# Altium schematic sheet Motor Phase.SchDoc
size A; SheetNumber: 4; SheetTotal: 4
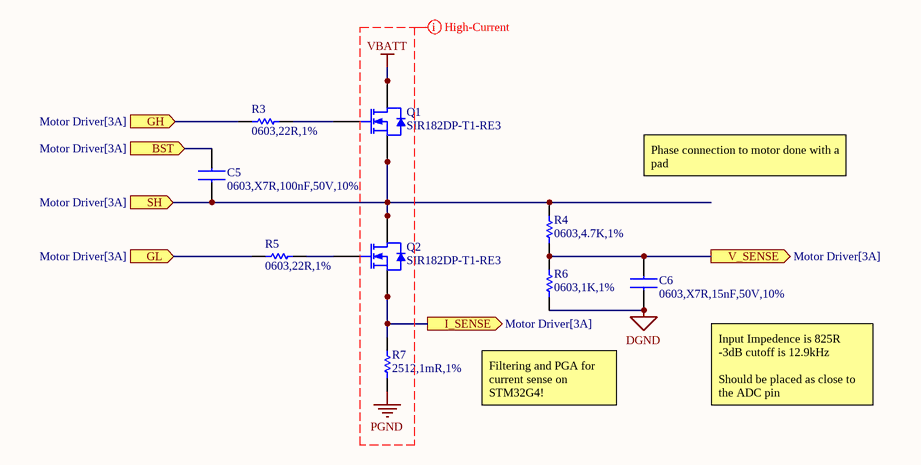
[diagram p0: Motor Phase.SchDoc]

## Parts
C5  0603,X7R,100nF,50V,10%  [CAPC1608X90N]
C6  0603,X7R,15nF,50V,10%  [CAPC1608X90N]
Q1  SIR182DP-T1-RE3  [POWERPAK-SO-8_L5.9-W4.9-P1.27-LS6.2-BL]
Q2  SIR182DP-T1-RE3  [POWERPAK-SO-8_L5.9-W4.9-P1.27-LS6.2-BL]
R3  0603,22R,1%  [RESC1608X55N]
R4  0603,4.7K,1%  [RESC1608X55N]
R5  0603,22R,1%  [RESC1608X55N]
R6  0603,1K,1%  [RESC1608X55N]
R7  2512,1mR,1%  [RES-SMD_L6.4-W3.2_RLP25]

## Ports
BST (in, see Motor Driver[3A]), GH (in, see Motor Driver[3A]), GL (in, see Motor Driver[3A]), I_SENSE (out, see Motor Driver[3A]), SH (in, see Motor Driver[3A]), V_SENSE (out, see Motor Driver[3A])

## Nets
DGND: C6.1 R6.1
PGND: R7.1
VBATT: Q1.5(D) Q1.6(D) Q1.7(D) Q1.8(D)
BST: C5.2 ; port BST
GH: R3.1 ; port GH
GL: R5.1 ; port GL
I_SENSE: Q2.1(S) Q2.2(S) Q2.3(S) R7.2 ; port I_SENSE
SH: C5.1 Q1.1(S) Q1.2(S) Q1.3(S) Q2.5(D) Q2.6(D) Q2.7(D) Q2.8(D) R4.2 ; port SH
V_SENSE: C6.2 R4.1 R6.2 ; port V_SENSE
NetQ1_4: Q1.4(G) R3.2
NetQ2_4: Q2.4(G) R5.2

## Layout directives
net class High-Current: PGND, VBATT

## Notes on the sheet
- Phase connection to motor done with a pad
- Filtering and PGA for current sense on STM32G4!
- Input Impedence is 825R
  -3dB cutoff is 12.9kHz
  Should be placed as close to the ADC pin

## Library data of the parts
C5 = CC0603KRX7R9BB104: 50V 100nF X7R ±10% 0603 Multilayer Ceramic Capacitors MLCC - SMD/SMT ROHS; Manufacturer_Name: YAGEO; Datasheet Link: https://componentsearchengine.com/Datasheets/2/CC0603KRX7R9BB104.pdf; Height: 0.9mm; Manufacturer_Part_Number: CC0603KRX7R9BB104; Mouser Part Number: 603-CC603KRX7R9BB104; Mouser Price/Stock: https://www.mouser.co.uk/ProductDetail/YAGEO/CC0603KRX7R9BB104?qs=vTakOoo5QyLvVCYM2ge8LQ%3D%3D; Arrow Part Number: CC0603KRX7R9BB104; Arrow Price/Stock: https://www.arrow.com/en/products/cc0603krx7r9bb104/yageo?utm_currency=USD&region=europe; LCSC Part #: C14663
C6 = CC0603KRX7R9BB153: 50V 15nF X7R ±10% 0603 Multilayer Ceramic Capacitors MLCC - SMD/SMT ROHS; Manufacturer_Name: YAGEO; Datasheet Link: https://componentsearchengine.com/Datasheets/2/CC0603KRX7R9BB104.pdf; Height: 0.9mm; Manufacturer_Part_Number: CC0603KRX7R9BB153; Mouser Part Number: 603-CC603KRX7R9BB104; Mouser Price/Stock: https://www.mouser.co.uk/ProductDetail/YAGEO/CC0603KRX7R9BB104?qs=vTakOoo5QyLvVCYM2ge8LQ%3D%3D; Arrow Part Number: CC0603KRX7R9BB104; Arrow Price/Stock: https://www.arrow.com/en/products/cc0603krx7r9bb104/yageo?utm_currency=USD&region=europe; LCSC Part #: C107076
Q1 Q2 = SIR182DP-T1-RE3: 60V 117A 2.8mΩ@10V,15A 2V 1 N-Channel PowerPAKSO-8 MOSFETs ROHS; LCSC Part #: C467943
R3 R5 = RC0603FR-0722RL: 100mW Thick Film Resistor 75V ±100ppm/℃ ±1% 22Ω 0603 Chip Resistor - Surface Mount ROHS; Manufacturer_Name: YAGEO; Datasheet Link: http://www.farnell.com/datasheets/1868787.pdf; Height: 0.55mm; Manufacturer_Part_Number: RC0603FR-0722RL; Mouser Part Number: 603-RC0603FR-0722RL; Mouser Price/Stock: https://www.mouser.co.uk/ProductDetail/YAGEO/RC0603FR-0722RL?qs=diQw95jMAeMOsxb8bne7fg%3D%3D; Arrow Part Number: RC0603FR-0722RL; Arrow Price/Stock: https://www.arrow.com/en/products/rc0603fr-0722rl/yageo?region=nac; LCSC Part #: C107701
R4 = RC0603FR-074K7L: 100mW Thick Film Resistor 75V ±100ppm/℃ ±1% 4.7kΩ 0603 Chip Resistor - Surface Mount ROHS; Manufacturer_Name: YAGEO; Datasheet Link: https://www.mouser.com/catalog/specsheets/YAGEO_PYu_RC_Group_51_RoHS_L_12.pdf; Height: 0.55mm; Manufacturer_Part_Number: RC0603FR-074K7L; LCSC Part #: C99782
R6 = RC0603FR-071KL: 100mW Thick Film Resistor 75V ±100ppm/℃ ±1% 1kΩ 0603 Chip Resistor - Surface Mount ROHS; Manufacturer_Name: YAGEO; Datasheet Link: https://www.mouser.com/catalog/specsheets/YAGEO_PYu_RC_Group_51_RoHS_L_12.pdf; Height: 0.55mm; Manufacturer_Part_Number: RC0603FR-071KL; LCSC Part #: C22548
R7 = PA2512FKF7T0R001E: 3W 1mΩ Surface Mount Current Sense Resistor ±100ppm/℃ ±1% 2512 Current Sense Resistors / Shunt Resistors ROHS; LCSC Part #: C723380